# EAGLE design beatbelt (EAGLE 6.4)
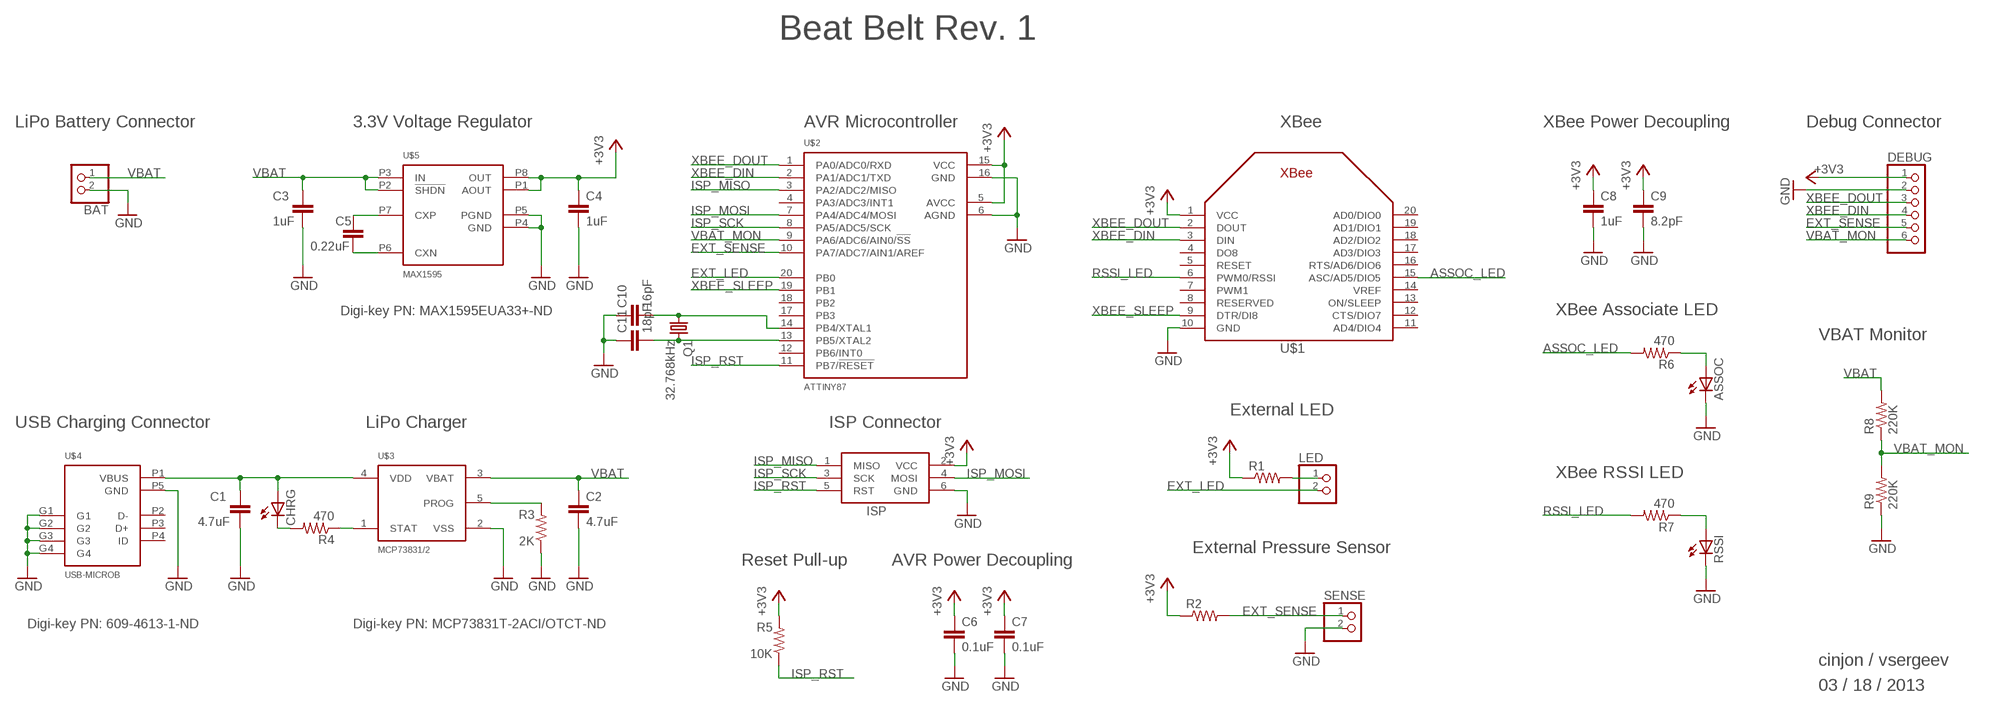
[diagram p0: schematic, sheet 1]

## Parts
ASSOC  LEDCHIPLED_0805  [CHIPLED_0805]
BAT  JST_2PIN-SMT-RA  [JST-PH-2-SMT-RA]
C1  4.7uF  C-EUC0805  [C0805]
C2  4.7uF  C-EUC0805  [C0805]
C3  1uF  C-EUC0805  [C0805]
C4  1uF  C-EUC0805  [C0805]
C5  0.22uF  C-EUC0603  [C0603]
C6  0.1uF  C-EUC0805  [C0805]
C7  0.1uF  C-EUC0805  [C0805]
C8  1uF  C-EUC0805  [C0805]
C9  8.2pF  C-EUC0805  [C0805]
C10  16pF  C-EUC0603  [C0603]
C11  18pF  C-EUC0603  [C0603]
CHRG  LEDCHIPLED_0805  [CHIPLED_0805]
DEBUG  PINHD-1X6  [1X06]
ISP  AVRISP-6  [AVRISP]
LED  PINHD-1X2  [1X02]
Q1  32.768kHz  CRYSTALTC26V  [TC26V]
R1  R-US_R0805  [R0805]
R2  R-US_R0805  [R0805]
R3  2K  R-US_R0805  [R0805]
R4  470  R-US_R0805  [R0805]
R5  10K  R-US_R0805  [R0805]
R6  470  R-US_R0805  [R0805]
R7  470  R-US_R0805  [R0805]
R8  220K  R-US_R0805  [R0805]
R9  220K  R-US_R0805  [R0805]
RSSI  LEDCHIPLED_0805  [CHIPLED_0805]
SENSE  PINHD-1X2  [1X02]
U$1  XBEE  [XBEE]
U$2  ATTINY87  [SOIC20S]
U$3  MCP73831/2  [SOT23-5L]
U$4  USB-MICROB  [USB-MICROB]
U$5  MAX1595  [UMAX8]

## Nets
+3V3: C4.1 C6.1 C7.1 C8.1 C9.1 DEBUG.1 ISP.2(VCC) R1.1 R2.1 R5.2 U$1.1(VCC) U$2.5(AVCC) U$2.15(VCC) U$5.P1(AOUT) U$5.P8(OUT)
ASSOC_LED: R6.2 U$1.15(ASC/AD5/DIO5)
EXT_LED: LED.2 U$2.20(PB0)
EXT_SENSE: DEBUG.5 R2.2 SENSE.1 U$2.10(PA7/ADC7/AIN1/AREF)
GND: ASSOC.C BAT.2 C1.2 C2.2 C3.2 C4.2 C6.2 C7.2 C8.2 C9.2 C10.1 C11.1 DEBUG.2 ISP.6(GND) R3.1 R9.1 RSSI.C SENSE.2 U$1.10(GND) U$2.6(AGND) U$2.16(GND) U$3.2(VSS) U$4.G1 U$4.G2 U$4.G3 U$4.G4 U$4.P5(GND) U$5.P4(GND) U$5.P5(PGND)
ISP_MISO: ISP.1(MISO) U$2.3(PA2/ADC2/MISO)
ISP_MOSI: ISP.4(MOSI) U$2.7(PA4/ADC4/MOSI)
ISP_RST: ISP.5(RST) R5.1 U$2.11(PB7/!RESET)
ISP_SCK: ISP.3(SCK) U$2.8(PA5/ADC5/SCK)
N$1: CHRG.C R4.2
N$2: LED.1 R1.2
N$3: R3.2 U$3.5(PROG)
N$4: R4.1 U$3.1(STAT)
N$5: C1.1 CHRG.A U$3.4(VDD) U$4.P1(VBUS)
N$6: ASSOC.A R6.1
N$7: C5.1 U$5.P7(CXP)
N$8: C5.2 U$5.P6(CXN)
N$9: R7.1 RSSI.A
N$10: C10.2 Q1.1 U$2.14(PB4/XTAL1)
N$11: C11.2 Q1.2 U$2.13(PB5/XTAL2)
RSSI_LED: R7.2 U$1.6(PWM0/RSSI)
VBAT: BAT.1 C2.1 C3.1 R8.2 U$3.3(VBAT) U$5.P2(!SHDN) U$5.P3(IN)
VBAT_MON: DEBUG.6 R8.1 R9.2 U$2.9(PA6/ADC6/AIN0/!SS)
XBEE_DIN: DEBUG.4 U$1.3(DIN) U$2.2(PA1/ADC1/TXD)
XBEE_DOUT: DEBUG.3 U$1.2(DOUT) U$2.1(PA0/ADC0/RXD)
XBEE_SLEEP: U$1.9(DTR/DI8) U$2.19(PB1)
Unconnected: U$1.4(DO8) U$1.5(RESET) U$1.7(PWM1) U$1.8(RESERVED) U$1.11(AD4/DIO4) U$1.12(CTS/DIO7) U$1.13(ON/SLEEP) U$1.14(VREF) U$1.16(RTS/AD6/DIO6) U$1.17(AD3/DIO3) U$1.18(AD2/DIO2) U$1.19(AD1/DIO1) U$1.20(AD0/DIO0) U$2.4(PA3/ADC3/INT1) U$2.12(PB6/INT0) U$2.17(PB3) U$2.18(PB2) U$4.P2(D-) U$4.P3(D+) U$4.P4(ID)

## Notes on the sheet
- Beat Belt Rev. 1
- LiPo Battery Connector | 3.3V Voltage Regulator | AVR Microcontroller | XBee | XBee Power Decoupling | Debug Connector
- Digi-key PN: MAX1595EUA33+-ND | XBee Associate LED
- VBAT Monitor
- External LED
- USB Charging Connector | LiPo Charger | ISP Connector
- XBee RSSI LED
- External Pressure Sensor
- Reset Pull-up | AVR Power Decoupling
- Digi-key PN: 609-4613-1-ND | Digi-key PN: MCP73831T-2ACI/OTCT-ND
- cinjon / vsergeev
- 03 / 18 / 2013

## Library data of the parts
ASSOC CHRG RSSI = led:LED: LED OSRAM: - CHIPLED LG R971, LG N971, LY N971, LG Q971, LY Q971, LO R971, LY R971 LH N974, LH R974 LS Q976, LO Q976, LY Q976 LO Q996 - Hyper CHIPLED LW Q18S LB Q993, LB Q99A, LB R99A - SideLED LS A670, LO A670, LY A670, LG A670, LP A670 LB A673, LV A673, LT A673, LW A673 LH A674 LY A675 LS A676, LA A676, LO A676, LY A676, LW A676 LS A679, LY A679, LG A679 - Hyper Micro SIDELED® LS Y876, LA Y876, LO Y876, LY Y876 LT Y87S - SmartLED LW L88C, LW L88S LB L89C, LB L89S, LG L890 LS L89K, LO L89K, LY L89K LS L896, LA L896, LO L896, LY L896 - TOPLED LS T670, LO T670, LY T670, LG T670, LP T670 LSG T670, LSP T670, LSY T670, LOP T670, LYG T670 LG T671, LOG T671, LSG T671 LB T673, LV T673, LT T673, LW T673 LH T674 LS T676, LA T676, LO T676, LY T676, LB T676, LH T676, LSB T676, LW T676 LB T67C, LV T67C, LT T67C, LS T67K, LO T67K, LY T67K, LW E67C LS E67B, LA E67B, LO E67B, LY E67B, LB E67C, LV E67C, LT E67C LW T67C LS T679, LY T679, LG T679 LS T770, LO T770, LY T770, LG T770, LP T770 LB T773, LV T773, LT T773, LW T773 LH T774 LS E675, LA E675, LY E675, LS T675 LS T776, LA T776, LO T776, LY T776, LB T776 LHGB T686 LT T68C, LB T68C - Hyper Mini TOPLED® LB M676 - Mini TOPLED Santana® LG M470 LS M47K, LO M47K, LY M47K Source: http://www.osram.convergy.de LUXEON: - LUMILED® LXK2-PW12-R00, LXK2-PW12-S00, LXK2-PW14-U00, LXK2-PW14-V00 LXK2-PM12-R00, LXK2-PM12-S00, LXK2-PM14-U00 LXK2-PE12-Q00, LXK2-PE12-R00, LXK2-PE12-S00, LXK2-PE14-T00, LXK2-PE14-U00 LXK2-PB12-K00, LXK2-PB12-L00, LXK2-PB12-M00, LXK2-PB14-N00, LXK2-PB14-P00, LXK2-PB14-Q00 LXK2-PR12-L00, LXK2-PR12-M00, LXK2-PR14-Q00, LXK2-PR14-R00 LXK2-PD12-Q00, LXK2-PD12-R00, LXK2-PD12-S00 LXK2-PH12-R00, LXK2-PH12-S00 LXK2-PL12-P00, LXK2-PL12-Q00, LXK2-PL12-R00 Source: www.luxeon.com KINGBRIGHT: KA-3528ASYC Source: www.kingbright.com
BAT = adafruit:JST_2PIN: JST 2-Pin Connectors of various flavors SMT-RA (S2B-PH-SM4) 4UConnector #17311 SMT (B2B-PH-SM4) THM-RA (S2B-PH) THM (B2B-PH)
C1-C11 = rcl:C-EU: CAPACITOR, European symbol
DEBUG = pinhead:PINHD-1X6: PIN HEADER
ISP = adafruit:AVRISP: AVR ISP HEADER Standard 6 pin header for AVR programming
LED SENSE = pinhead:PINHD-1X2: PIN HEADER
Q1 = crystal:CRYSTAL: CRYSTAL; OC_FARNELL: unknown; OC_NEWARK: unknown
R1-R9 = rcl:R-US_: RESISTOR, American symbol
U$1 = adafruit:XBEE
U$2 = ivan:ATTINY87
U$3 = ivan:MCP73831/2
U$4 = ivan:USB-MICROB
U$5 = ivan:MAX1595

## Board
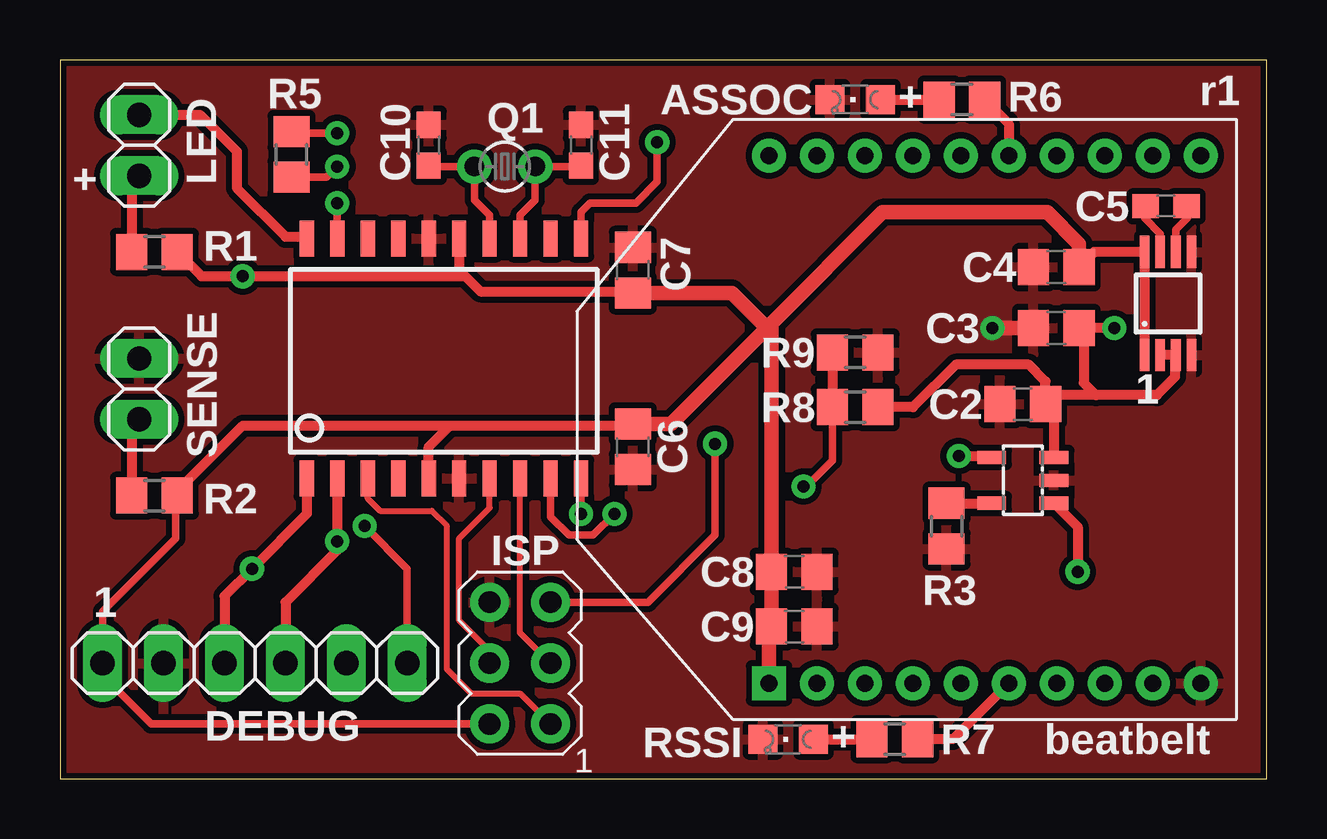
[diagram p1: board, top side]
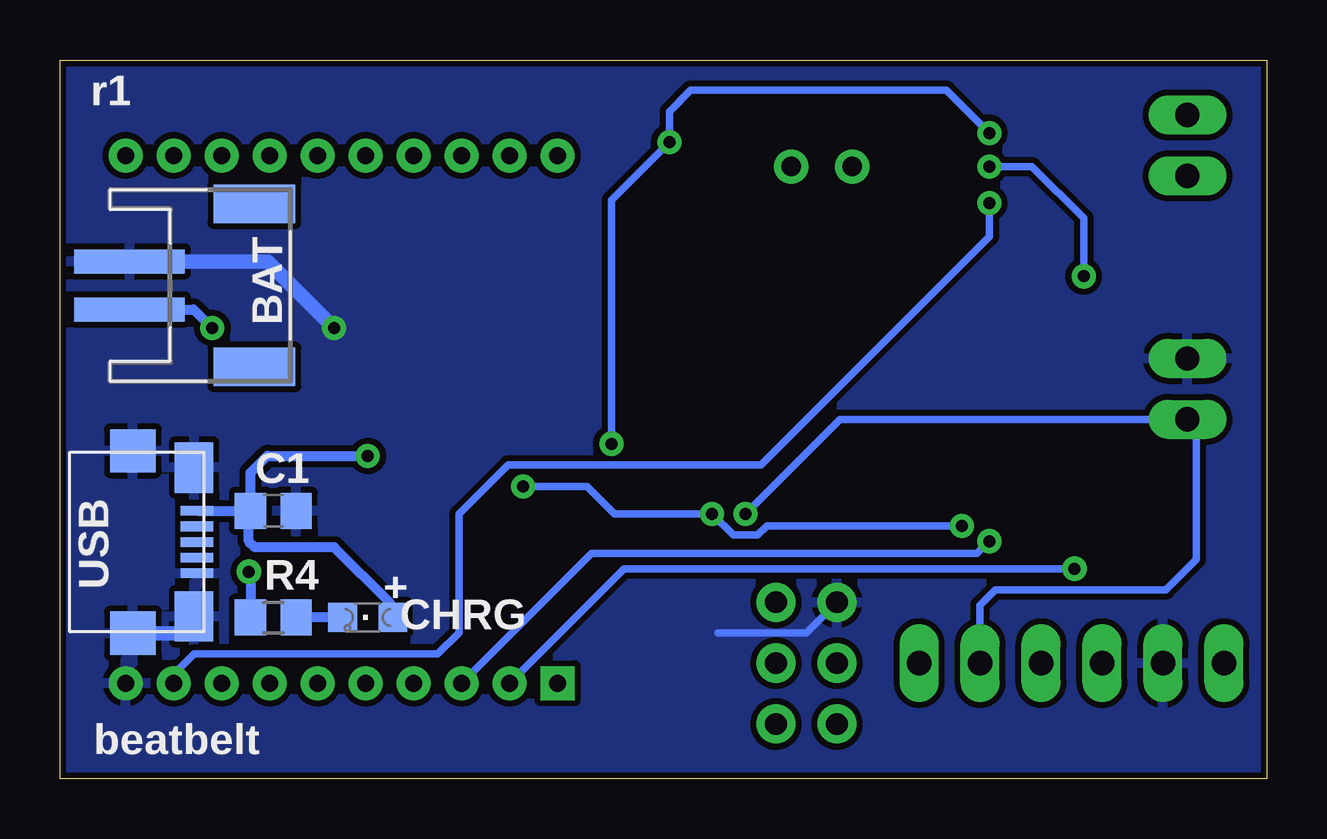
[diagram p2: board, bottom side, seen from below]

Size 50.29 x 29.97 mm. Coordinates in mm from the lower left corner, seen from the top.
Outline: 0,0 50.29,0 50.29,29.97 0,29.97 0,0
Copper layers (1*16): Top 0.035mm / dielectric 1.5mm / Bottom 0.035mm
Design rules "SparkFun-mod": minimum track width 8mil, minimum drill 15mil, track to track 6mil, track to pad 6mil, pad to pad 6mil, via to via 6mil, smd to smd 6mil, copper to edge 10mil, drill to drill 8mil, minimum pad ring 12mil, minimum via ring 10mil, stop-mask expansion 4mil, vias tented up to drill 25mil, thermal gap 10mil

### Footprints (pad centres in the part's own frame; a part is rotated, then mirrored left to right if it is on the bottom)
CHIPLED_0805 = smd 1.2 x 1.2: A 0,-1.05; C 0,1.05
JST-PH-2-SMT-RA = smd 1 x 4.6: 1 1,-3.7; 2 -1,-3.7 | smd 1.6 x 3.4: NC1 -3.4,1.5; NC2 3.4,1.5
C0805 = smd 1.3 x 1.5: 1 -0.95,0; 2 0.95,0
C0603 = smd 1.1 x 1: 1 -0.85,0; 2 0.85,0
1X06 = drill 1.016 long: 1 -6.35,0; 2 -3.81,0; 3 -1.27,0; 4 1.27,0; 5 3.81,0; 6 6.35,0
AVRISP = drill 0.9 pad 1.626: 1 -1.27,2.54; 2 1.27,2.54; 3 -1.27,0; 4 1.27,0; 5 -1.27,-2.54; 6 1.27,-2.54
1X02 = drill 1.016 long: 1 -1.27,0; 2 1.27,0
TC26V = drill 0.813: 1 -1.27,0; 2 1.27,0
R0805 = smd 1.3 x 1.5: 1 -0.95,0; 2 0.95,0
XBEE = drill 0.7 pad 1.422 square: 1 -11,5.5 | drill 0.7 pad 1.422: 2 -11,3.5; 3 -11,1.5; 4 -11,-0.5; 5 -11,-2.5; 6 -11,-4.5; 7 -11,-6.5; 8 -11,-8.5; 9 -11,-10.5; 10 -11,-12.5; 11 11,-12.5; 12 11,-10.5; 13 11,-8.5; 14 11,-6.5; 15 11,-4.5; 16 11,-2.5; 17 11,-0.5; 18 11,1.5; 19 11,3.5; 20 11,5.5
SOIC20S = smd 0.6 x 1.5: 1 -5.715,-5; 2 -4.445,-5; 3 -3.175,-5; 4 -1.905,-5; 5 -0.635,-5; 6 0.635,-5; 7 1.905,-5; 8 3.175,-5; 9 4.445,-5; 10 5.715,-5; 11 5.715,5; 12 4.445,5; 13 3.175,5; 14 1.905,5; 15 0.635,5; 16 -0.635,5; 17 -1.905,5; 18 -3.175,5; 19 -4.445,5; 20 -5.715,5
SOT23-5L = smd 0.55 x 1.2: 1 -0.95,-1.3; 2 0,-1.3; 3 0.95,-1.3; 4 0.95,1.3; 5 -0.95,1.3
USB-MICROB = smd 2.1 x 1.6: G1 -1.8,-0.125; G2 4.4,-0.125 | smd 1.8 x 1.9: G3 -2.5,-2.675; G4 5.1,-2.675 | smd 0.4 x 1.35: P1 0,0; P2 0.65,0; P3 1.3,0; P4 1.95,0; P5 2.6,0
UMAX8 = smd 0.4 x 1.35: P1 0,-4.3; P2 0.65,-4.3; P3 1.3,-4.3; P4 1.95,-4.3; P5 1.95,0; P6 1.3,0; P7 0.65,0; P8 0,0

### Placement (x,y rotation side)
ASSOC  33.15,28.32 90 top
BAT  43.69,20.57 270 bottom
C1  41.4,11.18 0 bottom
C2  40.13,15.62 180 top
C3  41.53,18.8 180 top
C4  41.53,21.34 180 top
C5  46.1,23.88 0 top
C6  23.88,13.84 270 top
C7  23.88,21.21 90 top
C8  30.61,8.64 0 top
C9  30.61,6.35 0 top
C10  15.37,26.42 270 top
C11  21.72,26.42 270 top
CHRG  37.47,6.73 90 bottom
DEBUG  8.13,4.83 0 top
ISP  19.18,4.83 180 top
LED  3.3,26.42 90 top
Q1  18.54,25.53 0 top
R1  3.94,21.97 180 top
R2  3.94,11.81 180 top
R3  36.96,10.54 90 top
R4  41.4,6.73 0 bottom
R5  9.65,26.04 270 top
R6  37.59,28.32 0 top
R7  34.8,1.65 0 top
R8  33.15,15.49 0 top
R9  33.15,17.78 180 top
RSSI  30.35,1.65 90 top
SENSE  3.3,16.26 90 top
U$1  35.05,14.99 90 top
U$2  16,17.53 0 top
U$3  40.13,12.45 90 top
U$4  44.58,11.18 270 bottom
U$5  45.21,21.97 0 top

### Tracks (layer width: path | path; a pad name or v marks a point on that pad's centre or on a via)
+3V3  (via drill 0.5)
  Top 0.305: ISP.2 3.81,2.29 1.78,4.32 DEBUG.1 1.78,6.99 4.83,10.03 4.83,11.75 R2.1 | R5.2 11.12,25.09 v11.56,25.53
  Top 0.406: U$5.P1 U$5.P8 43.11,21.97 C4.1 | U$2.5 15.37,13.84 16.26,14.73 | 16.26,14.73 23.82,14.73 C6.1 | U$2.15 16.64,21.21 16.89,20.95 | 16.89,20.95 17.53,20.32 23.82,20.32 C7.1 | R2.1 4.89,12 7.62,14.73 16.26,14.73 | R1.1 5.9,20.95 v7.62,20.95 16.89,20.95
  Top 0.61: 29.66,18.99 34.29,23.62 41.15,23.62 42.48,22.29 C4.1 | 29.66,18.99 C8.1 C9.1 29.55,6.25 U$1.1 | 29.66,18.99 29.46,18.8 | 29.46,18.8 25.46,14.79 C6.1 | 29.46,18.8 28,20.26 C7.1
  Bottom 0.305: v7.62,20.95 7.62,23.37 9.78,25.53 v11.56,25.53
ASSOC_LED
  Top 0.406: R6.2 39.55,27.31 U$1.15
EXT_LED
  Top 0.406: LED.2 5.84,27.69 7.37,26.16 7.37,24.64 9.4,22.61 10.21,22.61 U$2.20
EXT_SENSE  (via drill 0.5)
  Top 0.305: U$2.10 v21.72,11.05
  Top 0.406: SENSE.1 2.99,14.67 R2.2
  Bottom 0.305: v21.72,11.05 17.78,14.99 SENSE.1 2.92,14.61 2.92,9.14 4.19,7.87 11.3,7.87 11.94,7.24 DEBUG.5
GND  (via drill 0.5)
  Top 0.61: v38.86,18.8 C3.2
  Bottom 0.305: ISP.6 19.18,6.1 22.86,6.1
  Bottom 0.61: BAT.2 41.64,21.57 v38.86,18.8 | U$4.G2 45.4,6.08 U$4.G4
  pour Top (isolate 0.254): 0.38,0.38 0.38,29.84 49.91,29.59 49.91,0.38
  pour Bottom (isolate 0.254): 0.38,29.84 49.91,29.59 49.91,0.38 0.38,0.38
ISP_MISO
  Top 0.254: ISP.1 19.18,3.56 17.14,3.56 16.13,4.57 16.13,10.54 15.49,11.18 13.34,11.18 12.83,11.68 U$2.3
ISP_MOSI
  Top 0.254: U$2.7 17.91,11.3 16.64,10.03 16.64,6.6 17.91,5.33 ISP.4
ISP_RST  (via drill 0.5)
  Top 0.305: ISP.5 24.51,7.37 27.3,10.16 v27.3,13.97 | R5.1 9.71,26.92 v11.56,26.92 | U$2.11 21.72,23.62 22.1,24 24,24 24.89,24.89 v24.89,26.54
  Bottom 0.305: v11.56,26.92 13.34,28.7 24,28.7 24.89,27.81 v24.89,26.54 27.3,24.13 v27.3,13.97
ISP_SCK
  Top 0.254: ISP.3 19.18,6.1 U$2.8
N$1
  Bottom 0.406: CHRG.C R4.2
N$2
  Top 0.406: LED.1 2.99,24.83 R1.2
N$3
  Top 0.406: R3.2 U$3.5
N$4  (via drill 0.5)
  Top 0.406: U$3.1 42.42,10.51 v42.42,8.64
  Bottom 0.406: v42.42,8.64 42.35,8.57 R4.1
N$5  (via drill 0.5)
  Top 0.406: v37.47,13.46 38.77,13.46 U$3.4
  Bottom 0.406: U$4.P1 C1.1 | CHRG.A 36.54,7.33 38.86,9.65 42.16,9.65 42.42,9.91 42.42,11.11 C1.1 | C1.1 42.35,12.77 41.66,13.46 v37.47,13.46
N$6
  Top 0.406: ASSOC.A R6.1
N$7
  Top 0.305: U$5.P7 45.86,22.72 45.21,23.37 45.21,23.84 C5.1
N$8
  Top 0.305: U$5.P6 46.51,22.89 46.99,23.37 46.99,23.84 C5.2
N$9
  Top 0.406: RSSI.A R7.1
N$10
  Top 0.305: C10.2 15.41,25.53 Q1.1 17.27,24.13 17.91,23.5 U$2.14
N$11
  Top 0.305: C11.2 21.68,25.53 Q1.2 19.81,24.13 19.18,23.5 U$2.13
RSSI_LED
  Top 0.406: U$1.6 37.22,1.65 R7.2
VBAT  (via drill 0.5)
  Top 0.406: U$5.P2 U$5.P3 46.48,17.64 46.48,16.76 45.72,16 43.18,16 | 43.18,16 41.46,16 C2.1 | C2.1 41.43,15.27 U$3.3 | C2.1 41.08,16.58 40.39,17.27 37.34,17.27 35.56,15.49 R8.2 | v43.94,18.8 42.67,18.8 | 42.67,18.8 C3.1 | 42.67,18.8 42.67,16.51 43.18,16
  Bottom 0.406: BAT.1 44.72,19.57 v43.94,18.8
VBAT_MON  (via drill 0.5)
  Top 0.305: U$2.9 20.45,10.92 21.21,10.16 22.23,10.16 v23.11,11.05 | R8.1 32.2,13.27 31.11,12.19 v30.99,12.19 | DEBUG.6 14.48,8.76 v12.7,10.54
  Top 0.406: R9.2 R8.1
  Bottom 0.305: v30.99,12.19 28.32,12.19 27.18,11.05 v23.11,11.05 22.23,10.16 21.21,10.16 20.83,10.54 v12.7,10.54
XBEE_DIN  (via drill 0.5)
  Top 0.406: U$2.2 v11.56,9.91 11.56,9.53 9.4,7.37 DEBUG.4
  Bottom 0.305: 11.81,9.65 v11.56,9.91 12.06,9.4 28.14,9.4 U$1.3
XBEE_DOUT  (via drill 0.5)
  Top 0.406: U$2.1 10.29,11.05 v8,8.76 6.86,7.62 DEBUG.3
  Bottom 0.305: U$1.2 26.77,8.76 v8,8.76
XBEE_SLEEP  (via drill 0.5)
  Top 0.305: U$2.19 v11.56,24
  Bottom 0.305: U$1.9 45.55,4.36 44.7,5.21 34.54,5.21 33.66,6.1 33.66,11.05 31.62,13.08 21.08,13.08 11.56,22.61 v11.56,24

### Text on the board
tNames: + | r1 | + | 1 | 1 | + | beatbelt
bNames: r1 | USB | + | beatbelt